# Altium schematic sheet saw_filter_pcb.SchDoc
size A4
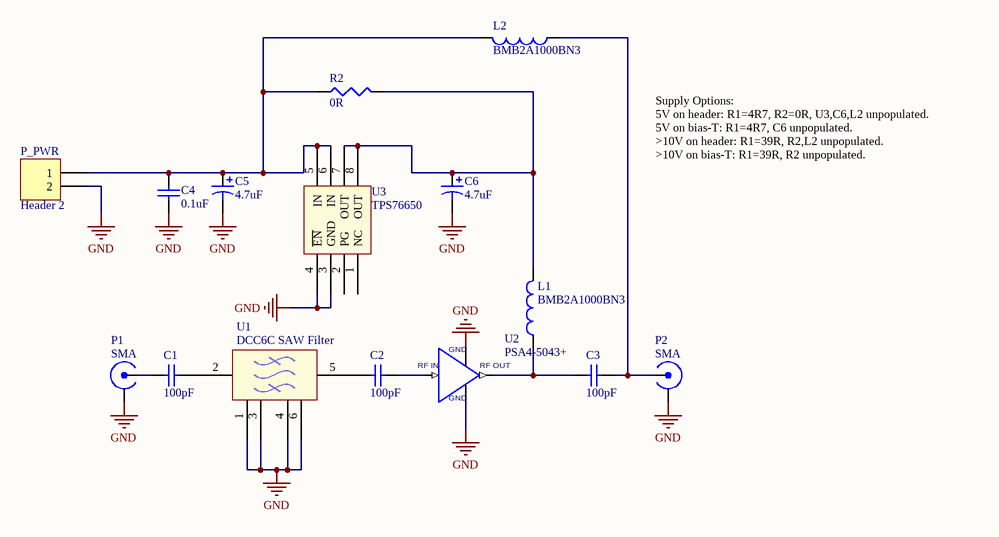
[diagram p0: saw_filter_pcb.SchDoc]

## Parts
C1  value 100pF  [1608[0603]]  (hidden comment: Cap Semi)
C2  value 100pF  [1608[0603]]  (hidden comment: Cap Semi)
C3  value 100pF  [1608[0603]]  (hidden comment: Cap Semi)
C4  value 0.1uF  [1608[0603]]  (hidden comment: Cap Semi)
C5  value 4.7uF  [C0805]  (hidden comment: Cap Pol3)
C6  value 4.7uF  [C0805]  (hidden comment: Cap Pol3)
L1  BMB2A1000BN3  [6-0805_N]
L2  BMB2A1000BN3  [6-0805_N]
P1  value SMA  [SMA_EDGE]  (hidden comment: SMA Con)
P2  value SMA  [SMA_EDGE]  (hidden comment: SMA Con)
P_PWR  Header 2  [HDR1X2]
R2  value 0R  [J1-0603]  (hidden comment: Res3)
U1  DCC6C SAW Filter  [DCC6C]
U2  PSA4-5043+  [SOT-343_M]
U3  TPS76650  [TPS76633]

## Nets
GND: C4.1 C5.2 C6.2 P1.2 P2.2 P_PWR.2 U1.1(IN) U1.3(IN) U1.4(IN) U1.6(IN) U2.2(GND) U2.4 U3.3(GND) U3.4(~{EN})
NetC1_1: C1.1 P1.1
NetC1_2: C1.2 U1.2(IN)
NetC2_1: C2.1 U1.5
NetC2_2: C2.2 U2.3(RF-IN)
NetC3_1: C3.1 L1.1 U2.1(RF-OUT)
NetC3_2: C3.2 L2.1 P2.1
NetC4_2: C4.2 C5.1 L2.2 P_PWR.1 R2.1 U3.5(IN) U3.6(IN)
NetC6_1: C6.1 L1.2 R2.2 U3.7(OUT) U3.8(OUT)

Not connected (* = marked no-connect by the designer): U3 1(NC) 2(PG)

## Notes on the sheet
- Supply Options:
  5V on header: R1=4R7, R2=0R, U3,C6,L2 unpopulated.
  5V on bias-T: R1=4R7, C6 unpopulated.
  >10V on header: R1=39R, R2,L2 unpopulated.
  >10V on bias-T: R1=39R, R2 unpopulated.
- (in symbol PSA4-5043+) RF IN; RF OUT

## Library data of the parts
C1-C4 = Cap Semi: Capacitor (Semiconductor SIM Model); Published: 8-Jun-2000; LatestRevisionDate: 29-May-2009; LatestRevisionNote: IPC-7351 Footprint Added.; PackageReference: C1206; Publisher: Altium Limited; PackageDescription: Chip Capacitor
C5 C6 = Cap Pol3: Polarized Capacitor (Surface Mount); Published: 8-Jun-2000; LatestRevisionDate: 29-May-2009; LatestRevisionNote: IPC-7351 Footprint Added.; PackageReference: C0805; Publisher: Altium Limited; PackageDescription: Chip Capacitor
L1 L2 = Inductor: Code_IEC: 1005; Value: 100mH; Published: 8-Jun-2000; LatestRevisionDate: 29-May-2009; LatestRevisionNote: IPC-7351 Footprint Added.; PackageReference: 0402-A; Publisher: Altium Limited; PackageDescription: Chip Inductor; Code_JEITA: 0402
P1 P2 = SMA Con: Power Connector
P_PWR = Header 2: Header, 2-Pin; LatestRevisionDate: 17-Jul-2002; LatestRevisionNote: Re-released for DXP Platform.; Publisher: Altium Limited
R2 = Res3: Resistor; Published: 8-Jun-2000; LatestRevisionDate: 29-May-2009; LatestRevisionNote: IPC-7351 Footprint Added.; PackageReference: J1-0603; Publisher: Altium Limited; PackageDescription: Chip Resistor